# Altium schematic sheet MicroSD_SDMMC&QUADSPI.SchDoc
size A2
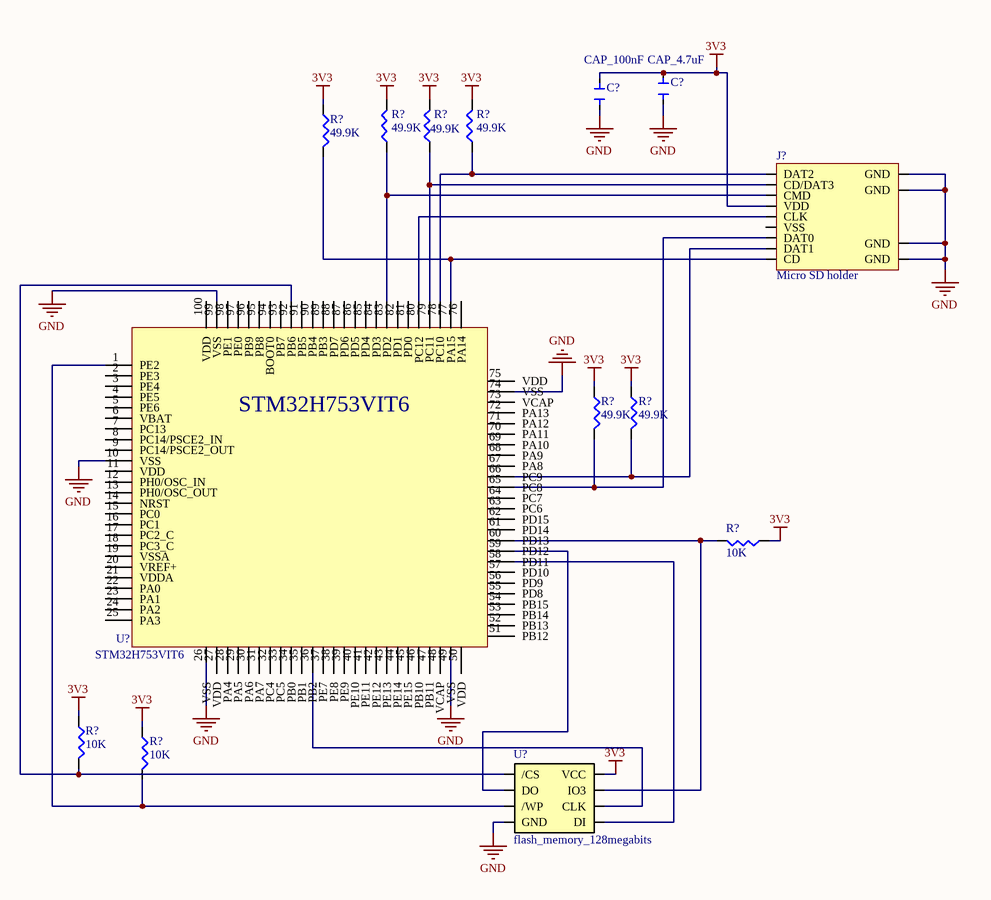
[diagram p0: MicroSD_SDMMC&QUADSPI.SchDoc]

## Parts
(Parts that share a designator on the sheet are numbered #1, #2 ... from top to bottom, then left to right.)
C?#1  CAP_4.7uF  [CAP_4.7uF]
C?#2  CAP_100nF  [CAP_100nF]
J?  Micro SD holder  [Edge Connector]
R?#1  49.9K
R?#2  49.9K
R?#3  49.9K
R?#4  49.9K
R?#5  49.9K
R?#6  49.9K
R?#7  10K  [RESC1005X37N]
R?#8  10K  [RESC1005X37N]
R?#9  10K  [RESC1005X37N]
U?#1  STM32H753VIT6  [LQFP100-14x14mm]
U?#2  flash_memory_128megabits  [SOIC-8-208mil]

## Nets
3V3: C?#1.1 C?#2.1 J?.4(VDD) R?#1.2 R?#2.2 R?#3.2 R?#4.1 R?#5.1 R?#6.1 R?#7.1 R?#8.1 R?#9.1 U?#2.8(VCC)
GND: C?#1.2 C?#2.2 J?.10(GND) J?.11(GND) J?.12(GND) J?.13(GND) U?#1.10(VSS) U?#1.99(VSS) U?#2.4(GND)
NetJ?_1: J?.1(DAT2) R?#3.1 U?#1.78(PC10)
NetJ?_2: J?.2(CD/DAT3) R?#2.1 U?#1.79(PC11)
NetJ?_3: J?.3(CMD) R?#1.1 U?#1.83(PD2)
NetJ?_5: J?.5(CLK) U?#1.80(PC12)
NetJ?_7: J?.7(DAT0) R?#5.2
NetJ?_8: J?.8(DAT1) R?#6.2
NetJ?_9: J?.9(CD) R?#4.2 U?#1.77(PA15)
NetR?#7_2: R?#7.2 U?#2.7(IO3)
NetR?#8_2: R?#8.2 U?#1.92(PB6) U?#2.1(/CS)
NetR?#9_2: R?#9.2 U?#1.1(PE2) U?#2.3(/WP)

Not connected (* = marked no-connect by the designer): J? 6(VSS); U?#1 2(PE3) 3(PE4) 4(PE5) 5(PE6) 6(VBAT) 7(PC13) 8(PC14/PSCE2_IN) 9(PC14/PSCE2_OUT) 11(VDD) 12(PH0/OSC_IN) 13(PH0/OSC_OUT) 14(NRST) 15(PC0) 16(PC1) 17(PC2_C) 18(PC3_C) 19(VSSA) 20(VREF+) 21(VDDA) 22(PA0) 23(PA1) 24(PA2) 25(PA3) 26(VSS) 27(VDD) 28(PA4) 29(PA5) 30(PA6) 31(PA7) 32(PC4) 33(PC5) 34(PB0) 35(PB1) 36(PB2) 37(PE7) 38(PE8) 39(PE9) 40(PE10) 41(PE11) 42(PE12) 43(PE13) 44(PE14) 45(PE15) 46(PB10) 47(PB11) 48(VCAP) 49(VSS) 50(VDD) 51(PB12) 52(PB13) 53(PB14) 54(PB15) 55(PD8) 56(PD9) 57(PD10) 58(PD11) 59(PD12) 60(PD13) 61(PD14) 62(PD15) 63(PC6) 64(PC7) 65(PC8) 66(PC9) 67(PA8) 68(PA9) 69(PA10) 70(PA11) 71(PA12) 72(PA13) 73(VCAP) 74(VSS) 75(VDD) 76(PA14) 81(PD0) 82(PD1) 84(PD3) 85(PD4) 86(PD5) 87(PD6) 88(PD7) 89(PB3) 90(PB4) 91(PB5) 93(PB7) 94(BOOT0) 95(PB8) 96(PB9) 97(PE0) 98(PE1) 100(VDD); U?#2 2(DO) 5(DI) 6(CLK)

## Library data of the parts
C?#1 = CAP_4.7uF: CAP  4.7uF 25V X7R ±10% 1206 Ceramic Capacitors RoHS; manufacturer: FH; manufacturer part number: 1206B475K250NT; value: 4.7uF; supplier: LCSC; supplier part number: C132148; ComponentLink1Description: Datasheet; ComponentLink1URL: https://www.lcsc.com/product-detail/C132148.html?s_z=n_FH%25201206B475K250N
C?#2 = CAP_100nF: CAP 100nF 50V X7R ±10% 0603 Ceramic Capacitors RoHS; manufacturer: YAGEO; manufacturer part number: CC0603KRX7R9BB104; value: 100nf; supplier: LCSC; supplier part number: C14663; ComponentLink1Description: Datasheet; ComponentLink1URL: https://www.lcsc.com/datasheet/C14663.pdf
J? = TF-CARD H1.8 SY: -40⊥~+70⊥ 2mm Gold Card Slot MicroSD card (TF card) Copper alloy Self-bouncing SMD SD Card / Memory Card Connector ROHS; Manufacturer: SHOU HAN; Supplier: LCSC; Supplier Part Number: C7529391; Manufacturer Part Number: TF-CARD H1.8 SY; Category: Memory Cards; Stock: 12390; Pricing: 10=0.483, 10=0.4412, 10=0.0606, 10=0.0528, 100=0.3471, 100=0.0476, 100=0.3799, 100=0.0415, 300=0.3291, 300=0.3006, 300=0.036, 300=0.0413, 1000=0.273, 1000=0.0326, 1000=0.0375, 1000=0.2988, 5000=0.2677, 5000=0.0293, 5000=0.2446, 5000=0.0336, 10000=0.2526, 10000=0.2307, 10000=0.0276, 10000=0.0317 (HKD)
R?#1-R?#6 = RES_0603_49.9K: 49.9kΩ ±1% 100mW 0603 Thick Film Resistor; Manufacturer: FOJAN; Manufacturer Part Number: FRC0603F4992TS; Supplier: LCSC; Supplier Part Number: C2930109
R?#7-R?#9 = RES_0402_10K: RES SMD 10K OHM 1% 1/16W 0402; Manufacturer: Yageo; Manufacturer Part Number: AC0402FR-0710KL; Additional Feature: LASER TRIMMABLE; Power: 62.5mW; Rated Temperature: 70°C; Value: 10kR; Temperature Coefficient: 100ppm/°C; Working Voltage: 50V; Package Height: 0.32mm; Package Length: 1mm; Package Width: 0.5mm; Reference Standard: AEC-Q200; Supplier: LCSC; Supplier Part Number: C144807; RoHS: Yes; Category: Chip SMD Resistors; Stock: 1122213; Pricing: 1=0.1, 10=0.019, 50=0.0116, 100=0.0095, 500=0.00638, 1000=0.00544, 5000=0.00391 (USD); Mounting Technology: Surface Mount; Pins: 2; Package Shape: Rectangular; Case/Package: 0402; Terminal Finish: Nickel; Min Operating Temperature: -55°C; Max Operating Temperature: 155°C; Tolerance: 1%; JESD-609 Code: e3; Resistor Type: FIXED RESISTOR; Construction: Chip; Package Style: SMTMeter; Packaging: Tape and Reel; Technology: METAL GLAZE/THICK FILM; Termination: Wraparound; Reach SVHC Compliant: Yes; RoHS Compliant: Yes; ComponentLink1URL: https://datasheet.ciiva.com:443/pdfs/VipMasterIC/IC/YAGO/YAGO-S-A0003597364/YAGO-S-A0003597364-1.pdf?src-supplier=IHS+Markit; ComponentLink1Description: https://datasheet.ciiva.com:443/pdfs/VipMasterIC/IC/YAGO/YAGO-S-A0003597364/YAGO-S-A0003597364-1.pdf?src-supplier=IHS+Markit; ComponentLink2URL: https://datasheet.ciiva.com/12656/pyu-ac-51-rohs-l-2-12656634.pdf?src-supplier=Mouser; ComponentLink2Description: https://datasheet.ciiva.com/12656/pyu-ac-51-rohs-l-2-12656634.pdf?src-supplier=Mouser; LCSC Part Number: C144807
U?#2 = 128Mb_FLASH: NOR Flash Serial (SPI, Dual SPI, Quad SPI) 3.3V 128M-bit 16M x 8 6ns 8-Pin SOIC Tube; Manufacturer: Winbond; Manufacturer Part Number: W25Q128JVSIQ; Frequency: 104MHz; Clock Frequency: 133MHz; Max Supply Current: 20mA; Max Supply Voltage: 3.6V; Memory Size: 16MB; Min Supply Voltage: 2.7V; Number of Circuits: 1; Operating Supply Voltage: 3V; Supplier: LCSC; Supplier Part Number: C97521; RoHS: Compliant; Category: Flash; Stock: 16290; Pricing: 1=1.97, 10=1.846, 25=1.7932, 90=1.71878, 180=1.6785, 270=1.65493, 540=1.61485, 1080=1.57507, 5040=1.48849 (USD); Ambient Temperature Range High: 85°C; Case/Package: SOIC; China RoHS: Compliant; Height: 2.16mm; Height - Seated (Max): 2.16mm; Interface: Serial; Length: 5.23mm; Lifecycle Status: Production; Max Operating Temperature: 85°C; Memory Format: FLASH; Min Operating Temperature: -40°C; Number of Terminals: 8; REACH SVHC: Yes; Schedule B: 8542320070, 8542320070|8542320070, 8542320070|8542320070|8542320070, 8542320070|8542320070|8542320070|8542320070; Terminal Pitch: 1.27mm; Width: 5.23mm; ComponentLink1URL: https://datasheet.octopart.com:443/W25Q128JVSIQ-Winbond-datasheet-181529389.pdf?src-supplier=ODG+(Origin+Data+Global); ComponentLink1Description: https://datasheet.octopart.com:443/W25Q128JVSIQ-Winbond-datasheet-181529389.pdf?src-supplier=ODG+(Origin+Data+Global); ComponentLink2URL: https://sigma.octopart.com:443/138898685/technical_drawing/Winbond-W25Q128JVSIQ.pdf?src-supplier=Upverter; ComponentLink2Description: https://sigma.octopart.com:443/138898685/technical_drawing/Winbond-W25Q128JVSIQ.pdf?src-supplier=Upverter; ComponentLink3URL: https://datasheet.octopart.com:443/W25Q128JVSIQ-Winbond-datasheet-138898757.pdf?src-supplier=Upverter; ComponentLink3Description: https://datasheet.octopart.com:443/W25Q128JVSIQ-Winbond-datasheet-138898757.pdf?src-supplier=Upverter; ComponentLink4URL: https://datasheet.octopart.com:443/W25Q128JVSIQ-Winbond-datasheet-138104337.pdf?src-supplier=Augswan; ComponentLink4Description: https://datasheet.octopart.com:443/W25Q128JVSIQ-Winbond-datasheet-138104337.pdf?src-supplier=Augswan